# EasyEDA Pro project ProPrj_4进4出_2026-07-08.epro, board PCB1
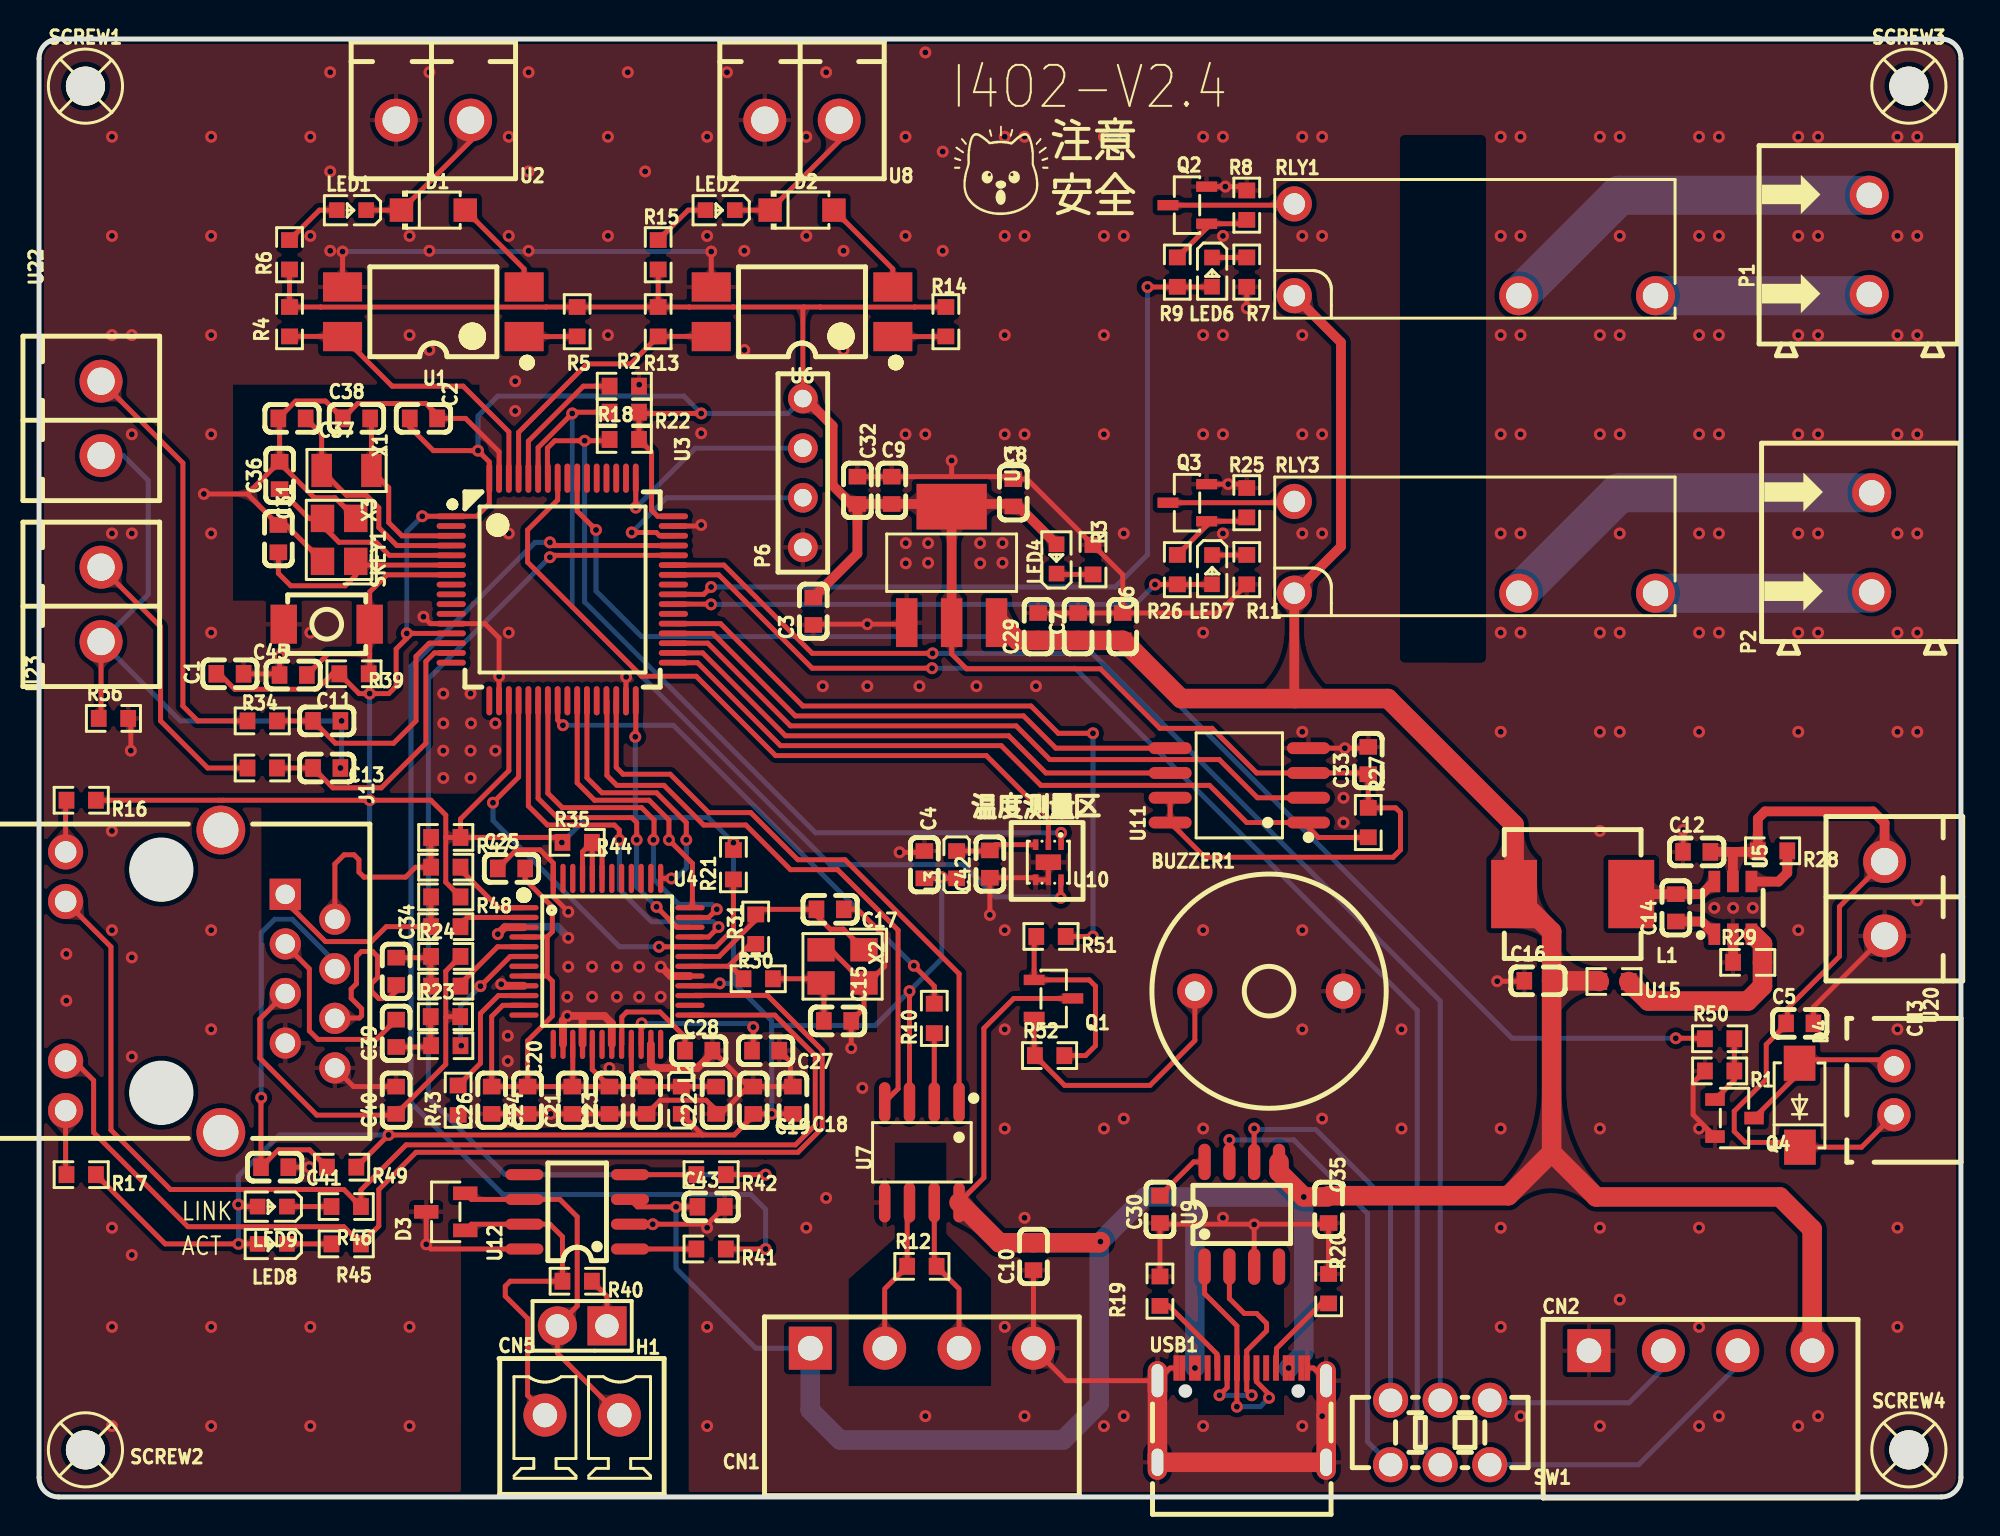
[diagram p8: board, top side]
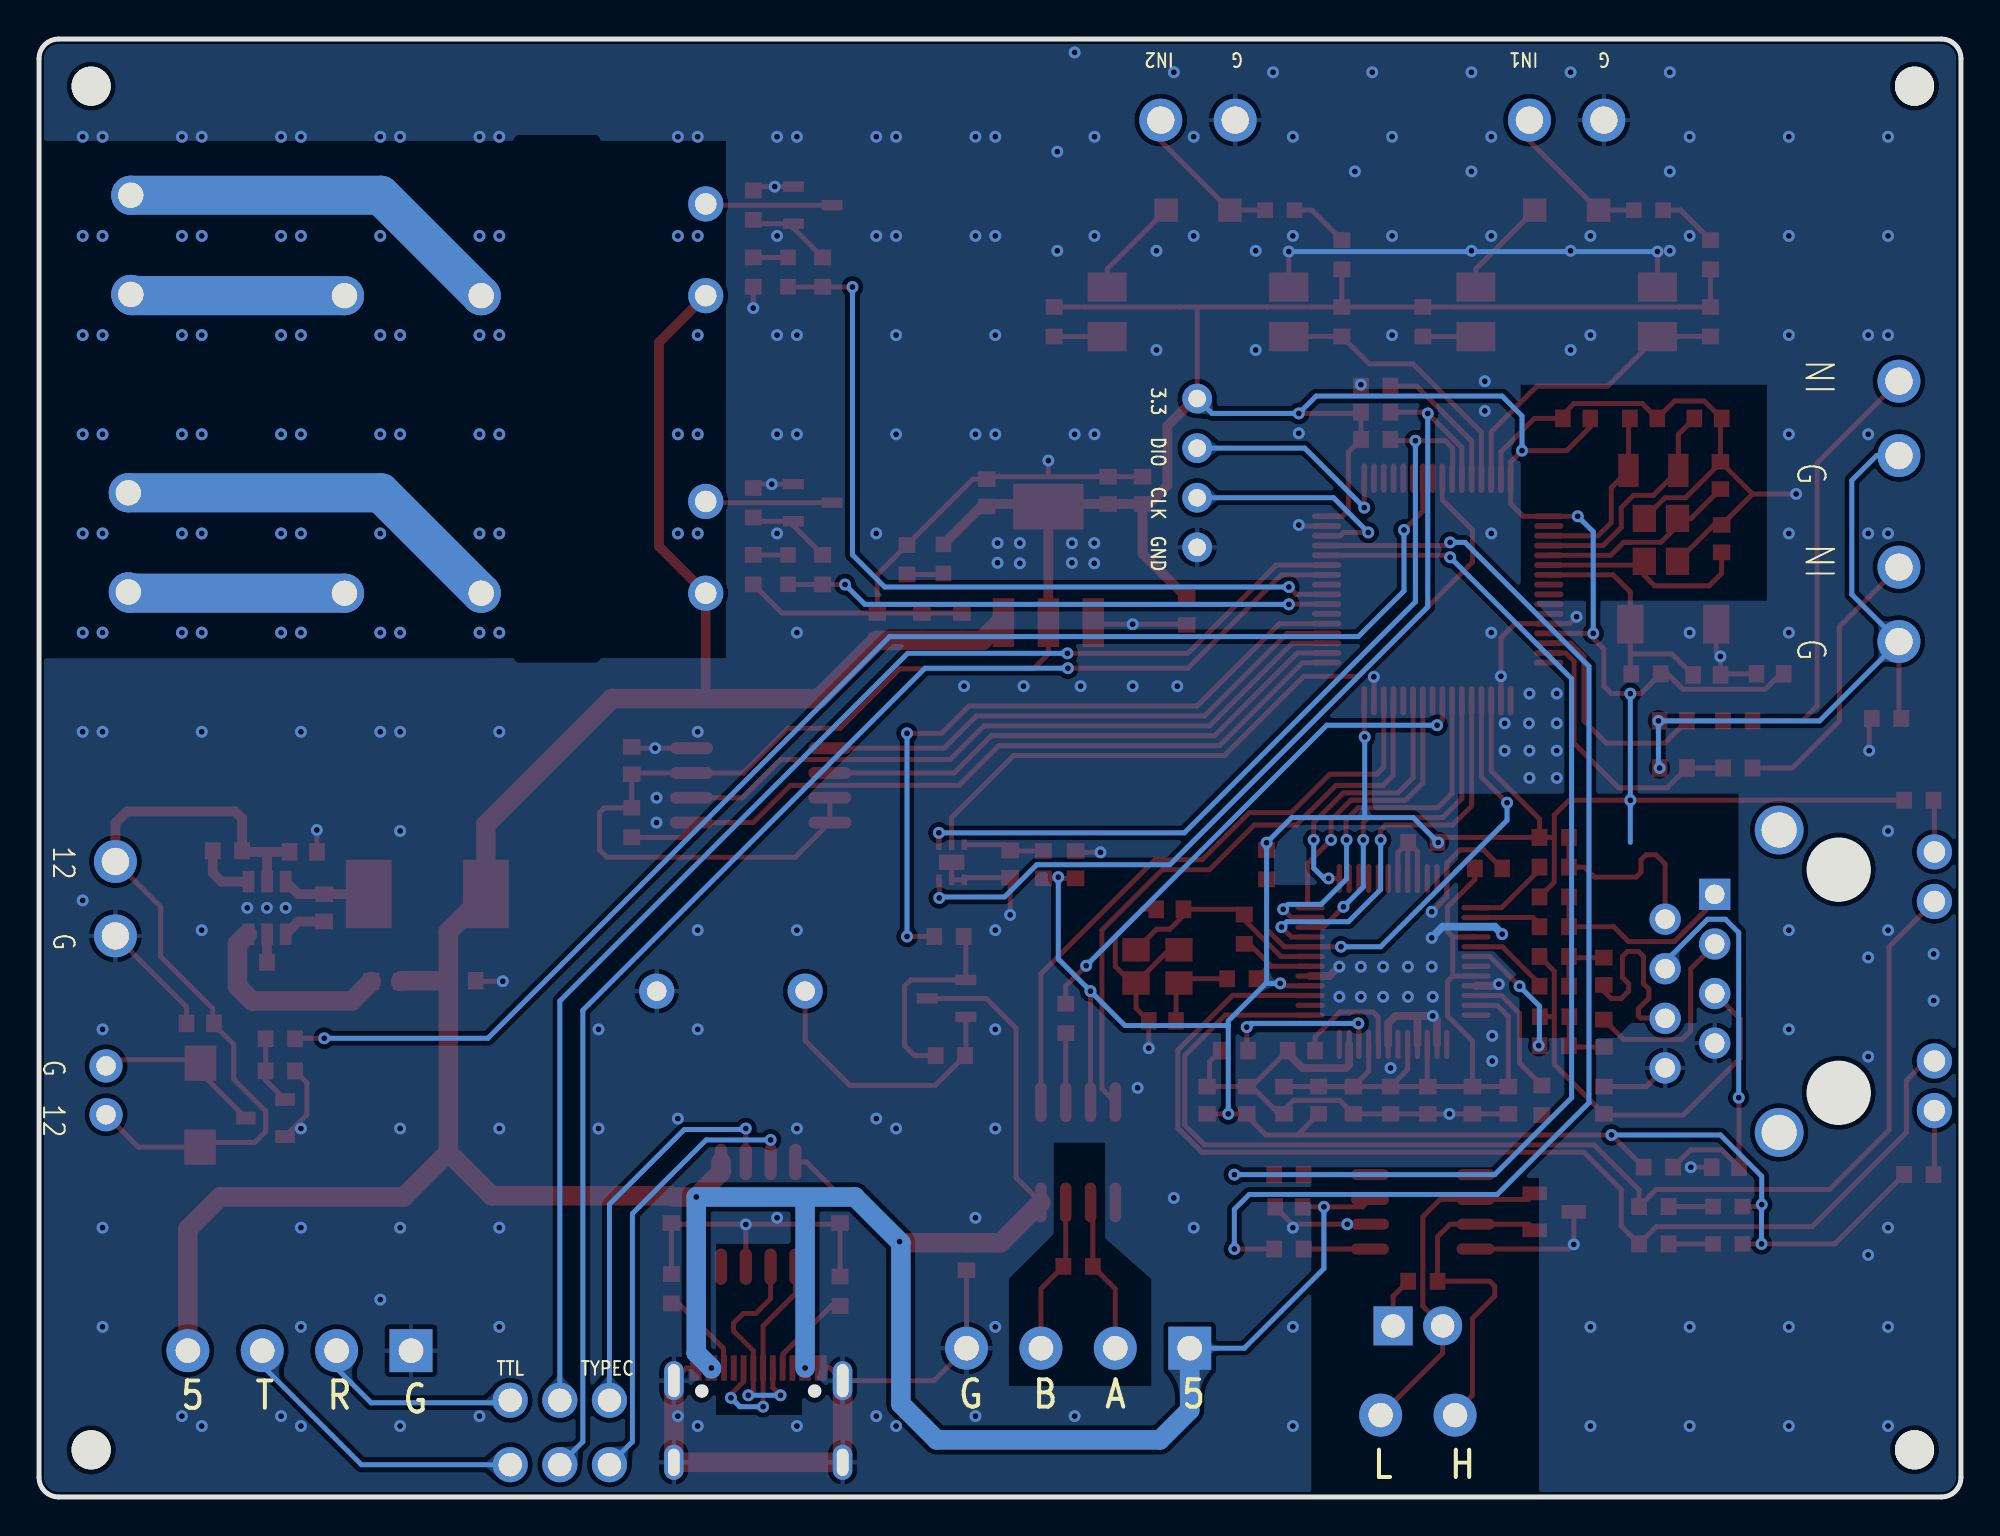
[diagram p9: board, bottom side, seen from below]

Outline 98.42 x 74.68 mm; copper layers: Top Layer, Bottom Layer. Coordinates in mm from the lower left corner of the outline.
Outline path: 0,73.68 0,1 arc(0.29,0.29) 1,0 97.42,0 arc(98.13,0.29) 98.42,1 98.42,73.68 arc(98.13,74.38) 97.42,74.68 1,74.68 arc(0.29,74.38) 0,73.68
Stack: Top Layer 0.035mm / Dielectric1 1.51mm FR4 er 4.5 / Bottom Layer 0.035mm

## Design rules (mm)
net 485_B: DP2
net 485_A: DP2
net TXN: DP3
net TXP: DP3
net RXN: DP4
net RXP: DP4
net $2N96: DP5
net $2N97: DP5
net CANL: DP6
net CANH: DP6
spacing copperThickness1oz (default): track to track 0.102, other pairs 0.152 to 0.3
spacing copperThickness2oz: track to track 0.203, other pairs 0.152 to 0.3
track width copperThickness1oz (default): min 0.127, default 0.254, max 2.54
track width copperThickness2oz: min 0.203, default 0.254, max 2.54
differential pair differentialPair (default): width min 0.127, default 0.254, max 2.54; gap min 0.152, default 0.152
net GND uses copperRegion

## Placement (name value [footprint] x y rotation side)
BUZZER1  2.4kHz  [BUZ-TH_BD12.0-P7.60-D0.6-FD]  62.99 25.91 0 top
C1  100nF  [C0603]  9.78 42.16 180 top
C2  100nF  [C0603]  19.69 55.25 180 top
C3  100nF  [C0603]  39.65 45.37 90 top
C4  100nF  [C0603]  45.34 32.39 270 top
C5  100nF  [C0603]  90.17 24.26 0 top
C6  100nF  [C0603]  55.5 44.58 90 top
C7  100nF  [C0603]  53.21 44.58 90 top
C8  100nF  [C0603]  49.89 51.44 270 top
C9  100nF  [C0603]  43.67 51.56 270 top
C10  100nF  [C0603]  50.93 12.32 90 top
C11  100nF  [C0603]  14.73 39.75 0 top
C12  4.7uF  [C0603]  84.89 33.04 0 top
C13  100nF  [C0603]  14.73 37.34 0 top
C14  100nF  [C0603]  83.82 30.18 90 top
C15  18pF  [C0603]  40.89 24.38 180 top
C16  10uF  [C0603]  76.76 26.44 0 top
C17  18pF  [C0603]  40.51 30.1 180 top
C18  100nF  [C0603]  38.61 20.32 270 top
C19  4.7uF  [C0603]  36.58 20.32 270 top
C20  100nF  [C0603]  25.02 20.32 90 top
C21  100nF  [C0603]  29.21 20.32 90 top
C22  100nF  [C0603]  34.67 20.32 90 top
C23  100nF  [C0603]  31.11 20.32 90 top
C24  100nF  [C0603]  27.3 20.32 90 top
C25  100nF  [C0603]  24.2 32.19 0 top
C26  4.7uF  [C0603]  23.18 20.32 90 top
C27  10nF  [C0603]  37.21 22.86 180 top
C28  4.7uF  [C0603]  33.78 22.86 180 top
C29  10uF  [C0603]  51.16 44.58 90 top
C30  100nF  [C0603]  57.4 14.73 270 top
C31  22pF  [C0603]  12.26 49.09 270 top
C32  10uF  [C0603]  41.91 51.56 270 top
C33  100nF  [C0603]  68.07 37.72 90 top
C34  6.8nF  [C0603]  18.29 26.92 270 top
C35  100nF  [C0603]  66.04 14.73 90 top
C36  22pF  [C0603]  12.32 52.32 270 top
C37  22pF  [C0603]  12.95 55.25 0 top
C38  22pF  [C0603]  16.26 55.25 0 top
C39  6.8nF  [C0603]  18.29 23.75 90 top
C40  10nF  [C0603]  18.29 20.32 90 top
C41  22nF  [C0603]  12.06 16.89 180 top
C42  100nF  [C0603]  48.69 32.42 90 top
C43  100nF  [C0603]  34.42 14.86 0 top
C45  100nF  [C0603]  13.02 42.1 0 top
CN1  WJ15EDGRC-3.81-04P-14-00A  [CONN-TH_WJ15EDGRC-3.81-4P]  45.21 7.62 0 top
CN2  WJ15EDGRC-3.81-04P-14-00A  [CONN-TH_WJ15EDGRC-3.81-4P]  85.09 7.49 0 top
CN3  B2B-XH-A(LF)(SN)  [CONN-TH_B2B-XH-A-LF-SN]  95 20.83 270 top
CN5  WJ15EDGVC-3.81-02P-14-00A  [CONN-TH_WJ15EDGVC-3.81-2P]  27.81 4.19 0 top
D1  SMF5.0A  [SOD-123FL_L2.7-W1.8-LS3.8-RD]  20.19 65.91 0 top
D2  SMF5.0A  [SOD-123FL_L2.7-W1.8-LS3.8-RD]  39.07 65.91 0 top
D3  NUP2105LT1G  [SOT-23-3_L2.9-W1.3-P1.90-LS2.4-BL-2]  20.83 14.61 90 top
D4  SS34  [SMA_L4.3-W2.6-LS5.0-FD]  90.17 20.07 270 top
H1  PZ254V-11-02P  [HDR-TH_2P-P2.54-V-M]  27.81 8.76 180 top
J1  HR911105A  [RJ45-TH_HR911105A]  8.25 26.42 270 top
L1  10uH  [IND-SMD_L7.3-W6.8]  78.54 30.88 180 top
L2  BLM18PG121SN1D  [L0603]  32.89 20.32 90 top
L3  BLM18PG121SN1D  [L0603]  46.99 32.39 90 top
LED1  NCD0603Y2  [LED0603-RD]  16 65.91 180 top
LED2  NCD0603Y2  [LED0603-RD]  34.88 65.91 180 top
LED4  NCD0603Y2  [LED0603-RD]  52.11 48.05 90 top
LED6  NCD0603Y2  [LED0603-RD]  60.07 62.74 270 top
LED7  NCD0603Y2  [LED0603-RD]  60.07 47.5 270 top
LED8  NCD0603Y2  [LED0603-RD]  11.95 12.96 180 top
LED9  NCD0603Y2  [LED0603-RD]  11.95 14.87 180 top
P1  WJ500V-5.08-2P  [CONN-TH_2P-P5.00_WJ500V-5.08-2P]  93.73 64.14 90 top
P2  WJ500V-5.08-2P  [CONN-TH_2P-P5.00_WJ500V-5.08-2P]  93.85 48.9 90 top
P6  4Pin  [4Pin-2.54]  39.12 52.45 90 top
Q1  S8050  [SOT-23-3_L2.9-W1.3-P1.90-LS2.3-BR]  51.95 25.53 180 top
Q2  S8050  [SOT-23-3_L2.9-W1.3-P1.90-LS2.3-BR]  58.8 66.17 0 top
Q3  S8050  [SOT-23-3_L2.9-W1.3-P1.90-LS2.3-BR]  58.8 50.93 0 top
Q4  AO3400A  [SOT-23-3_L2.9-W1.3-P1.90-LS2.4-BR]  86.83 19.41 180 top
R1  10kΩ  [R0603]  86.07 21.82 180 top
R2  1kΩ  [R0603]  29.97 56.9 180 top
R3  1kΩ  [R0603]  53.98 48.01 270 top
R4  10kΩ  [R0603]  12.83 60.2 90 top
R5  500Ω  [R0603]  27.56 60.2 270 top
R6  1kΩ  [R0603]  12.83 63.63 90 top
R7  1kΩ  [R0603]  61.85 62.74 90 top
R8  10kΩ  [R0603]  61.85 66.17 270 top
R9  1kΩ  [R0603]  58.29 62.74 90 top
R10  10kΩ  [R0603]  45.85 24.51 90 top
R11  1kΩ  [R0603]  61.85 47.5 90 top
R12  120Ω  [R0603]  45.21 11.81 0 top
R13  10kΩ  [R0603]  31.71 60.2 90 top
R14  500Ω  [R0603]  46.44 60.2 270 top
R15  1kΩ  [R0603]  31.71 63.63 90 top
R16  470Ω  [R0603]  2.16 35.69 180 top
R17  470Ω  [R0603]  2.16 16.51 180 top
R18  10kΩ  [R0603]  29.97 54.17 0 top
R19  5.1kΩ  [R0603]  57.4 10.54 90 top
R20  5.1kΩ  [R0603]  66.04 10.67 90 top
R21  10kΩ  [R0603]  35.56 32.39 90 top
R22  10kΩ  [R0603]  29.97 55.56 180 top
R23  50Ω  [R0603]  20.81 24.6 0 top
R24  50Ω  [R0603]  20.83 27.69 0 top
R25  10kΩ  [R0603]  61.85 50.93 270 top
R26  1kΩ  [R0603]  58.29 47.5 90 top
R27  4.7K  [R0603_1]  68.07 34.54 270 top
R28  100kΩ  [R0603]  88.78 33.1 180 top
R29  2.1kΩ  [R0603]  87.51 27.38 0 top
R30  0Ω  [R0603]  36.83 26.54 180 top
R31  1MΩ  [R0603]  36.7 29.08 90 top
R32  0Ω  [R0603]  20.83 32.26 180 top
R33  0Ω  [R0603]  20.83 29.21 180 top
R34  1kΩ  [R0603]  11.43 39.75 180 top
R35  1kΩ  [R0603]  11.43 37.34 180 top
R36  0Ω  [R0603]  3.81 39.88 0 top
R37  0Ω  [R0603]  20.83 26.16 180 top
R38  0Ω  [R0603]  20.83 23.11 180 top
R39  10kΩ  [R0603]  16.13 42.16 180 top
R40  120Ω  [R0603]  27.56 11.05 180 top
R41  220Ω  [R0603]  34.42 12.7 180 top
R42  220Ω  [R0603]  34.42 16.51 180 top
R43  12.4kΩ  [R0603]  21.46 20.32 90 top
R44  10kΩ  [R0603]  27.56 33.53 0 top
R45  1kΩ  [R0603]  15.73 12.96 180 top
R46  1kΩ  [R0603]  15.73 14.87 180 top
R47  50Ω  [R0603]  20.83 33.78 180 top
R48  50Ω  [R0603]  20.83 30.73 180 top
R49  10Ω  [R0603]  15.49 16.89 180 top
R50  1kΩ  [R0603]  86.07 23.47 0 top
R51  1kΩ  [R0603]  51.82 28.71 180 top
R52  10kΩ  [R0603]  51.75 22.61 0 top
RLY1  G5NB-1A-E-DC5V  [RELAY-TH_G5NB-1A-E-DCXX]  73.53 63.88 0 top
RLY3  G5NB-1A-E-DC5V  [RELAY-TH_G5NB-1A-E-DCXX]  73.53 48.64 0 top
SCREW1  -  [M2螺丝]  2.38 72.26 0 top
SCREW2  -  [M2螺丝]  2.38 2.41 0 top
SCREW3  -  [M2螺丝]  95.76 72.26 0 top
SCREW4  -  [M2螺丝]  95.76 2.41 0 top
SKEY1  TS-1185-B-A-B-A  [SW-SMD_L4.0-W3.0-LS5.0]  14.73 44.7 0 top
SW1  JS202011CQN  [SW-TH_JS202011CQN]  71.76 3.3 180 top
U1  PC817X2CSP9F  [SMD-4_L4.6-W6.5-P2.54-LS10.2-TL]  20.19 60.71 180 top
U2  2P-P3.81_KF2EDGV-3.81-2P  [CONN-TH_2P-P3.81_KF2EDGV-3.81-2P]  20.19 70.52 180 top
U3  STM32F103RET6  [LQFP-64_L10.0-W10.0-P0.50-LS12.0-BL]  26.8 46.48 270 top
U4  W5500  [LQFP-48_L7.0-W7.0-P0.50-LS9.0-BL]  29.08 27.43 270 top
U5  JW5026  [SOT-23-6_L2.9-W1.6-P0.95-LS2.8-BR]  86.75 30.18 270 top
U6  PC817X2CSP9F  [SMD-4_L4.6-W6.5-P2.54-LS10.2-TL]  39.07 60.71 180 top
U7  MAX13487EESA+T  [SOIC-8_L4.9-W3.9-P1.27-LS6.0-BL]  45.21 17.65 180 top
U8  2P-P3.81_KF2EDGV-3.81-2P  [CONN-TH_2P-P3.81_KF2EDGV-3.81-2P]  39.07 70.52 180 top
U9  CH340N  [SOP-8_L4.9-W3.9-P1.27-LS6.0-BL]  61.6 14.48 0 top
U10  STTS22HTR  [DFN-6_L2.0-W2.0-P0.65-BL-EP1.2]  51.69 32.51 180 top
U11  W25Q64JVSSIQ  [SOP-8_L5.3-W5.3-P1.27-LS8.0-BL]  61.47 36.45 90 top
U12  TJA1050T/CM,118  [SOIC-8_L5.0-W4.0-P1.27-LS6.0-BL]  27.56 14.61 90 top
U13  AMS1117-3.3  [SOT-223-3_L6.5-W3.4-P2.30-LS7.0-BR]  46.74 47.75 270 top
U15  11.2kΩ  [R0603]  80.66 26.4 180 top
U20  2P-P3.81_KF2EDGV-3.81-2P  [CONN-TH_2P-P3.81_KF2EDGV-3.81-2P]  94.51 30.64 90 top
U22  2P-P3.81_KF2EDGV-3.81-2P  [CONN-TH_2P-P3.81_KF2EDGV-3.81-2P]  3.17 55.25 270 top
U23  2P-P3.81_KF2EDGV-3.81-2P  [CONN-TH_2P-P3.81_KF2EDGV-3.81-2P]  3.17 45.72 270 top
USB1  typec  [USB-C-SMD_KH-TYPE-C-16P]  61.6 4.19 0 top
X1  32.768kHz  [CRYSTAL-SMD_L3.2-W1.5-1]  15.75 52.58 0 top
X2  25MHz  [CRYSTAL-SMD_4P-L3.2-W2.5-BL]  41.15 27.18 180 top
X3  8MHz  [CRYSTAL-SMD_4P-L3.2-W2.5-BL]  15.37 49.02 90 top

## Footprints (pads in the part's own frame, mm; a bottom-side part is the same pattern mirrored in y, then rotated)
4Pin-2.54
  round 1.524 hole 0.9: 1(-3.81,0) 2(-1.27,0) 3(1.27,0) 4(3.81,0)
BUZ-TH_BD12.0-P7.60-D0.6-FD
  round 1.8 hole 1: 1(-3.8,0) 2(3.8,0)
C0603
  rect 0.8x0.9 smd: 1(-0.7,0) 2(0.7,0)
CONN-TH_2P-P3.81_KF2EDGV-3.81-2P
  round 2.2 hole 1.4: 1(-1.905,0) 2(1.905,0)
CONN-TH_2P-P5.00_WJ500V-5.08-2P
  round 2 hole 1.3: 1(-2.54,0) 2(2.54,0)
CONN-TH_B2B-XH-A-LF-SN
  round 1.7 hole 1: 1(1.25,0) 2(-1.25,0)
CONN-TH_WJ15EDGRC-3.81-4P
  rect 2.2x2.2 hole 1.26: 1(-5.715,0)
  round 2.2 hole 1.26: 2(-1.905,0) 3(1.905,0) 4(5.715,0)
CONN-TH_WJ15EDGVC-3.81-2P
  round 2.2 hole 1.25: 1(-1.905,0) 2(1.905,0)
CRYSTAL-SMD_4P-L3.2-W2.5-BL
  rect 1.4x1.2 smd: 1(-1.1,-0.85) 2(1.1,-0.85) 3(1.1,0.85) 4(-1.1,0.85)
CRYSTAL-SMD_L3.2-W1.5-1
  rect 1.05x1.7 smd: 1(-1.275,0) 2(1.275,0)
DFN-6_L2.0-W2.0-P0.65-BL-EP1.2
  rect 0.28x0.55 smd: 1(-0.65,-0.9) 2(0.001,-0.9) 3(0.65,-0.9) 4(0.65,0.9) 5(0,0.9) 6(-0.65,0.9)
  rect 1.3x0.8 smd: 7(0.001,0)
HDR-TH_2P-P2.54-V-M
  rect 2x2 hole 1.2: 1(-1.27,0)
  round 2 hole 1.2: 2(1.27,0)
IND-SMD_L7.3-W6.8
  rect 2.35x3.5 smd: 1(-3,0) 2(3,0)
L0603
  rect 0.8x0.864 smd: 1(-0.7,0) 2(0.7,0)
LED0603-RD
  rect 0.8x0.8 smd: 1(-0.749,0) 2(0.749,0)
LQFP-48_L7.0-W7.0-P0.50-LS9.0-BL
  oval 0.27x1.5 smd: 1(-2.75,-4.25) 2(-2.25,-4.25) 3(-1.75,-4.25) 4(-1.25,-4.25) 5(-0.75,-4.25) 6(-0.25,-4.25) 7(0.25,-4.25) 8(0.75,-4.25) 9(1.25,-4.25) 10(1.75,-4.25) 11(2.25,-4.25) 12(2.75,-4.25) 25(2.75,4.25) 26(2.25,4.25) 27(1.75,4.25) 28(1.25,4.25) 29(0.75,4.25) 30(0.25,4.25) 31(-0.25,4.25) 32(-0.75,4.25) 33(-1.25,4.25) 34(-1.75,4.25) 35(-2.25,4.25) 36(-2.75,4.25)
  oval 1.5x0.27 smd: 13(4.25,-2.75) 14(4.25,-2.25) 15(4.25,-1.75) 16(4.25,-1.25) 17(4.25,-0.75) 18(4.25,-0.25) 19(4.25,0.25) 20(4.25,0.75) 21(4.25,1.25) 22(4.25,1.75) 23(4.25,2.25) 24(4.25,2.75) 37(-4.25,2.75) 38(-4.25,2.25) 39(-4.25,1.75) 40(-4.25,1.25) 41(-4.25,0.75) 42(-4.25,0.25) 43(-4.25,-0.25) 44(-4.25,-0.75) 45(-4.25,-1.25) 46(-4.25,-1.75) 47(-4.25,-2.25) 48(-4.25,-2.75)
LQFP-64_L10.0-W10.0-P0.50-LS12.0-BL
  oval 0.3x1.5 smd: 1(-3.75,-5.688) 2(-3.25,-5.688) 3(-2.75,-5.688) 4(-2.25,-5.688) 5(-1.75,-5.688) 6(-1.25,-5.688) 7(-0.75,-5.688) 8(-0.25,-5.688) 9(0.25,-5.688) 10(0.75,-5.688) 11(1.25,-5.688) 12(1.75,-5.688) 13(2.25,-5.688) 14(2.75,-5.688) 15(3.25,-5.688) 16(3.75,-5.688) 33(3.75,5.688) 34(3.25,5.688) 35(2.75,5.688) 36(2.25,5.688) 37(1.75,5.688) 38(1.25,5.688) 39(0.75,5.688) 40(0.25,5.688) 41(-0.25,5.688) 42(-0.75,5.688) 43(-1.25,5.688) 44(-1.75,5.688) 45(-2.25,5.688) 46(-2.75,5.688) 47(-3.25,5.688) 48(-3.75,5.688)
  oval 1.5x0.3 smd: 17(5.7,-3.738) 18(5.7,-3.238) 19(5.7,-2.738) 20(5.7,-2.238) 21(5.7,-1.738) 22(5.7,-1.238) 23(5.7,-0.739) 24(5.7,-0.238) 25(5.7,0.262) 26(5.7,0.762) 27(5.7,1.262) 28(5.7,1.762) 29(5.7,2.261) 30(5.7,2.762) 31(5.7,3.261) 32(5.7,3.762) 49(-5.7,3.762) 50(-5.7,3.261) 51(-5.7,2.762) 52(-5.7,2.261) 53(-5.7,1.762) 54(-5.7,1.262) 55(-5.7,0.762) 56(-5.7,0.262) 57(-5.7,-0.238) 58(-5.7,-0.739) 59(-5.7,-1.238) 60(-5.7,-1.738) 61(-5.7,-2.238) 62(-5.7,-2.738) 63(-5.7,-3.238) 64(-5.7,-3.738)
M2螺丝
  round 2 hole 2: 1(0,0)
R0603
  rect 0.806x0.864 smd: 1(-0.753,0) 2(0.753,0)
R0603_1
  rect 0.806x0.864 smd: 1(-0.753,0) 2(0.753,0)
RELAY-TH_G5NB-1A-E-DCXX
  round 1.8 hole 1.1: 1(-9.25,-2.35) 4(-9.25,2.35)
  round 2 hole 1.3: 2(2.25,-2.35) 3(9.25,-2.35)
RJ45-TH_HR911105A
  rect 1.6x1.6 hole 1: 1(-4.45,4.355)
  round 1.6 hole 1: 2(-3.18,6.895) 3(-1.91,4.355) 4(-0.64,6.895) 5(0.63,4.355) 6(1.9,6.895) 7(3.17,4.355) 8(4.44,6.895)
  round 1.8 hole 1.1: 9(-6.625,-6.895) 10(-4.085,-6.895) 11(4.085,-6.895) 12(6.625,-6.895)
  round 2.5 hole 1.8: SH1(-7.745,1.055) SH2(7.745,1.055)
SMA_L4.3-W2.6-LS5.0-FD
  rect 1.8x1.62 smd: 1(-2.15,-0.009) 2(2.15,0.009)
SMD-4_L4.6-W6.5-P2.54-LS10.2-TL
  rect 2x1.5 smd: 1(-4.65,1.27) 2(-4.65,-1.27) 3(4.65,-1.27) 4(4.65,1.27)
SOD-123FL_L2.7-W1.8-LS3.8-RD
  rect 1.2x1.2 smd: 1(-1.635,0) 2(1.635,0)
SOIC-8_L4.9-W3.9-P1.27-LS6.0-BL
  oval 0.588x2.045 smd: 1(-1.905,-2.57) 2(-0.635,-2.57) 3(0.635,-2.57) 4(1.905,-2.57) 5(1.905,2.57) 6(0.635,2.57) 7(-0.635,2.57) 8(-1.905,2.57)
SOIC-8_L5.0-W4.0-P1.27-LS6.0-BL
  oval 0.569x1.95 smd: 1(-1.905,-2.705) 2(-0.635,-2.705) 3(0.635,-2.705) 4(1.905,-2.705) 5(1.905,2.705) 6(0.635,2.705) 7(-0.635,2.705) 8(-1.905,2.705)
SOP-8_L4.9-W3.9-P1.27-LS6.0-BL
  oval 0.63x1.865 smd: 1(-1.905,-2.683) 2(-0.635,-2.683) 3(0.635,-2.683) 4(1.905,-2.683) 5(1.905,2.683) 6(0.635,2.683) 7(-0.635,2.683) 8(-1.905,2.683)
SOP-8_L5.3-W5.3-P1.27-LS8.0-BL
  oval 0.609x2.204 smd: 1(-1.905,-3.542) 2(-0.635,-3.542) 3(0.635,-3.542) 4(1.905,-3.542) 5(1.905,3.542) 6(0.635,3.542) 7(-0.635,3.542) 8(-1.905,3.542)
SOT-23-3_L2.9-W1.3-P1.90-LS2.3-BR
  rect 1.07x0.532 smd: 1(0.99,-0.95) 2(0.99,0.95) 3(-0.99,0)
SOT-23-3_L2.9-W1.3-P1.90-LS2.4-BL-2
  rect 0.7x1.25 smd: 1(-0.95,-1) 2(0.95,-1) 3(0,1)
SOT-23-3_L2.9-W1.3-P1.90-LS2.4-BR
  rect 1x0.65 smd: 1(1,-0.95) 2(1,0.95) 3(-1,0)
SOT-23-6_L2.9-W1.6-P0.95-LS2.8-BR
  rect 1.1x0.6 smd: 1(1.35,-0.95) 2(1.35,0) 3(1.35,0.95) 4(-1.35,0.95) 5(-1.35,0) 6(-1.35,-0.95)
SOT-223-3_L6.5-W3.4-P2.30-LS7.0-BR
  rect 2.5x1.1 smd: 1(2.97,-2.3) 2(2.97,0) 3(2.97,2.3)
  rect 2.34x3.6 smd: 4(-2.97,0)
SW-SMD_L4.0-W3.0-LS5.0
  rect 1.35x2 smd: 1(-2.2,0) 2(2.2,0)
SW-TH_JS202011CQN
  round 1.8 hole 1.2: 1(-2.54,-1.65) 2(0,-1.65) 3(2.54,-1.65) 4(-2.54,1.65) 5(0,1.65) 6(2.54,1.65)
USB-C-SMD_KH-TYPE-C-16P
  oval 1x2 hole 0.6x1.7: 1(-4.32,1.765) 2(4.32,1.765)
  oval 1x1.8 hole 0.6x1.4: 3(-4.32,-2.415) 4(4.32,-2.415)
  rect 0.3x1.3 smd: A1(-3.35,2.415) A4(-2.55,2.415) A5(-1.25,2.415) A6(-0.25,2.415) A7(0.25,2.415) A8(1.25,2.415) A9(2.55,2.415) A12(3.35,2.415) B1(3.05,2.415) B4(2.25,2.415) B5(1.75,2.415) B6(0.75,2.415) B7(-0.75,2.415) B8(-1.75,2.415) B9(-2.25,2.415) B12(-3.05,2.415)

## Nets
As in the schematic, except:
VCC3.3: C1.2 C2.2 C3.2 C4.2 C8.2 C9.2 C18.2 C19.2 C32.2 C33.1 L2.1 L3.1 LED4.2 LED8.2 LED9.2 P6.4 R4.2 R5.1 R6.1 R13.2 R14.1 R15.1 R16.1 R17.1 R18.2 R21.2 R22.1 R27.1 R39.2 R44.1 R47.1 R48.1 R49.1 U3.1 U3.13 U3.19 U3.32 U3.48 U3.64 U4.28 U7.3 U11.3 U11.7 U11.8 U13.2 U13.4
$2N103: J1.9 R16.2
$2N104: J1.12 R17.2

Pads without a net: J1 SH1 SH2; SCREW1 1; SCREW2 1; SCREW3 1; SCREW4 1; U4 7 12 13 18 24 26 38 39 40 41 42 46 47; U9 4; U12 5; USB1 A8 B8

## Via types
v1: diameter 0.61, hole 0.305, Top Layer to Bottom Layer, 360 vias

## Routing (per net, layer and track width the routed paths; a pad name or vN(x,y) marks a point on that pad's centre or on a via; arc(x,y) is an arc through that point)
12V: length 40.7
  Top Layer w0.254: CN3.1 93.33,17.92 D4.2 89.93,18.16 87.38,18.16 86.82,18.72 86.82,19.76 88.45,21.4 88.45,23.18 89.47,24.19 C5.1 89.54,24.32 89.54,25.02 92.2,27.69 92.2,30.24 U20.2
  Top Layer w0.5: 86.81,33.04 87.97,33.04 R28.2 88.02,34.75 88.39,35.12 93.92,35.12 94.51,34.52 U20.2 ; 86.81,33.04 C12.2 ; 86.81,33.04 86.75,32.98 U5.5
+5V: length 205.2
  Top Layer w0.254: U7.8 48.39,16.35 48.39,24 49.92,25.53 Q1.3 ; U12.3 30.64,14.86 v1(32.62,14.86) C43.1
  Top Layer w0.5: 64.3,40.89 64.28,40.91 RLY3.1 66.67,48.68 66.67,59.14 RLY1.1
  Top Layer w1: C16.2 77.46,17.65 ; C16.2 77.46,28.96 L1.2 75.54,34.44 69.08,40.89 58.48,40.89 C6.1 C7.1 C29.1 50.11,43.88 49.13,44.86 ; C16.2 79.87,26.44 79.91,26.4 ; 77.46,17.65 79.74,15.37 89.15,15.37 90.8,13.72 CN2.4 ; 77.46,17.65 75.25,15.43 C35.2 ; U7.8 49.18,13.02 C10.2 54.29,13.02 v1(54.36,13.08) ; U9.5 63.5,16.64 v1(64.77,15.37) 65.98,15.37
  Bottom Layer w0.254: CN1.1 36.7,7.62 32.62,11.7 v1(32.62,14.86)
  Bottom Layer w1: CN1.1 39.5,4.45 41.02,2.92 52.45,2.92 54.29,4.76 54.29,13.02 v1(54.36,13.08) 56.64,15.37 v1(64.77,15.37) 64.77,7.38 v1(63.99,6.61) 63.99,6.56 ; v1(59.2,6.61) 59.2,15.11
AGND: length 32.6
  Top Layer w0.254: U23.2 3.17,40 R36.1
  Bottom Layer w0.254: v1(15.43,37.34) 15.49,37.4 v1(15.49,39.75) 7.24,39.75 U23.2 5.59,46.23 5.59,52.07 4.32,53.34 U22.2
GND: length 258.3
  Top Layer w0.254: 36.32,21.02 C19.1 38.48,21.02 38.48,22.29 C27.1 ; 36.32,21.02 C28.1 ; 36.32,21.02 34.92,19.62 C22.1 34.67,19.81 34.16,20.32 31.82,20.32 C23.1 C21.1 C24.1 v1(26.2,19.62) C20.1 C26.1 ; C10.1 CN1.4 52.59,5.96 USB1.1 57.92,6.61 58.24,6.61 ; C36.1 12.32,55.18 C37.1 13.14,56.13 14.67,56.13 C38.1 16.32,56.01 19.81,56.01 20.39,55.43 C2.1 21.84,55.25 23.56,53.53 U3.63 ; C36.1 12.32,52.96 14.1,51.18 15.16,51.18 X3.2 ; C36.1 10.67,51.37 ; X2.2 40.55,28.03 X2.4 ; U13.1 44.36,44.7 v1(42.42,44.7) 39.69,44.7 C3.1 39.48,44.49 ; 10.67,51.37 v1(8.44,51.37) ; 10.67,51.37 C31.1 12.65,49.79 14.52,47.92 ; 45.34,33.09 45.27,33.02 v1(44.07,33.02) ; v1(74.68,26.42) 76.04,26.42 C16.1 ; R1.2 84.71,21.22 84.71,19.58 Q4.2 ; 59.79,51.88 v1(60.9,51.88) 61.65,51.88 R25.1 ; 62.24,13.97 v1(62.23,13.96) U9.3 ; 62.24,13.97 65.98,13.97 C35.1 R20.2 ; 62.24,13.97 57.47,13.97 C30.2 R19.2 ; v1(30.07,42.01) 30.06,42 U3.31 ; v1(48.69,29.81) C42.1 50.93,31.72 U10.4 U10.5 ; C6.2 C7.2 C29.2 ; C6.2 55.5,47.24 R3.1 50.6,52.14 C8.1 49.77,52.26 46.75,52.26 ; C6.2 60.38,45.28 R11.1 ; v1(84.2,34.16) 84.2,33.05 C12.1 ; 46.75,52.26 C9.1 C32.1 ; 46.75,52.26 46.74,52.27 v1(46.74,53.09) ; 12.32,43.02 C45.1 12.25,42.16 C1.1 ; X2.4 42.46,26.33 43.31,27.18 43.31,28.7 41.91,30.1 C17.1 ; X2.4 42.25,25.04 C15.1 41.47,24.26 41.59,24.13 v1(41.59,22.99) ; Q2.2 v1(60.75,67.12) 61.65,67.12 R8.1 ; U11.4 v1(66.87,38.35) 68.01,38.35 C33.2 ; U6.3 v1(34.42,63.79) ; U12.8 20.07,12.7 v1(19.83,12.94) D3.3 ; v1(12.32,43.05) 12.53,43.27 SKEY1.1 ; USB1.A12 65.27,6.61 USB1.2 ; R7.1 v1(61.85,60.9) ; R2.1 30.73,56.9 v1(30.73,56.97) ; v1(19.69,45.09) 20.04,44.73 22.83,44.73 23.56,44.01 v1(23.56,42.04) U3.18 ; U3.47 33.86,49.73 v1(33.91,49.78) ; U10.7 51.69,31.61 ; U12.2 v1(31.43,13.97) 34.23,13.97 C43.2 ; v1(27.1,29.97) 26.33,30.74 U4.48 26.33,32.47 25.65,33.15 24.45,33.15 C25.1 ; 15.54,61.98 v1(15.54,63.79) ; J1.8 16.11,21.02 C40.2 ; C5.2 90.87,25.09 U20.1 ; R36.2 4.7,39.74 v1(4.7,38.23) ; C41.1 13.83,16.89
  Top Layer w0.4: U4.14 26.83,24.42 v1(27.05,24.64) 27.81,24.64 ; 24.83,29.18 23.85,29.18 v1(23.5,28.83) ; 31.91,27.11 32.34,26.68 U4.29 ; 27.81,24.64 28.96,24.64 29.33,24.26 U4.19 ; 27.81,24.64 27.83,24.62 U4.16 ; C28.1 34.48,22.73 33.72,21.97 31.5,21.97 31.33,22.13 U4.23 ; v1(23.67,26.27) 23.75,26.18 24.83,26.18
  Top Layer w0.5: U5.2 86.75,28.82 R29.1
  Top Layer w1: USB1.2 USB1.4 USB1.3 USB1.1
  Bottom Layer w0.254: v1(15.54,63.79) v1(34.42,63.79)
  Bottom Layer w0.4: v1(27.1,28.64) 27.1,28.65 26.54,29.21 23.88,29.21 v1(23.5,28.83)
  vias: v1(1.4,27.81) v1(1.4,25.42) v1(3.73,69.67) v1(3.73,64.59) v1(3.73,59.51) v1(3.73,49.35) v1(3.73,34.11) v1(3.73,29.03) v1(3.73,13.79) v1(3.73,8.71) v1(3.73,3.63) v1(4.75,59.51) v1(4.75,54.43) v1(4.75,49.35) v1(4.75,27.64) v1(4.75,22.56) v1(4.75,12.4) v1(8.81,69.67) v1(8.81,64.59) v1(8.81,59.51) v1(8.81,54.43) v1(8.81,49.35) v1(8.81,44.27) v1(8.81,29.03) v1(8.81,23.95) v1(8.81,8.71) v1(8.81,3.63) v1(13.89,69.67) v1(13.89,64.59) v1(13.89,44.27) v1(13.83,16.89) v1(13.89,8.71) v1(13.89,3.63) v1(14.91,72.97) v1(14.91,67.89) v1(14.91,63.83) v1(18.97,64.59) v1(18.97,59.51) v1(18.97,8.71) v1(18.97,3.63) v1(19.99,72.97) v1(19.99,63.83) v1(19.99,58.75) v1(20.7,41.15) v1(20.7,39.62) v1(20.7,38.23) v1(20.7,36.83) v1(22.1,41.15) v1(22.12,39.62) v1(22.1,38.23) v1(22.1,36.83) v1(23.37,39.62) v1(23.37,38.23) v1(24,23.62) v1(24,22.33) v1(24.05,69.67) v1(24.05,64.59) v1(24.05,49.35) v1(24.05,44.27) v1(24.38,57.15) v1(24.38,55.63) v1(25.07,72.97) v1(25.07,67.89) v1(25.07,63.83) v1(27.1,27.16) v1(27.05,25.62) v1(28.32,27.16) v1(28.32,25.62) v1(29.13,69.67) v1(29.13,64.59) v1(29.13,59.51) v1(29.21,21.97) v1(29.59,27.16) v1(29.59,25.62) v1(30.15,72.97) v1(30.73,27.16) v1(30.73,25.62) v1(31.04,67.89) v1(31.83,27.16) v1(31.83,25.62) v1(33.91,54.48) v1(34.21,69.67) v1(34.21,64.59) v1(34.21,13.79) v1(34.21,8.71) v1(34.21,3.63) v1(35.23,72.97) v1(36.12,63.83) v1(36.12,58.75) v1(39.29,69.67) v1(39.29,64.59) v1(39.29,13.79) v1(40.13,41.53) v1(40.31,72.97) v1(40.31,15.32) v1(41.2,63.83) v1(41.2,58.75) v1(42.16,20.96) v1(42.42,41.53) v1(44.37,69.67) v1(44.37,64.59) v1(44.37,54.43) v1(44.39,48.86) v1(44.39,47.82) v1(45.08,41.53) v1(45.39,73.99) v1(45.39,54.43) v1(45.39,4.14) v1(45.53,48.86) v1(45.53,47.85) v1(46.28,68.91) v1(46.28,63.83) v1(48.01,41.53) v1(48.2,48.86) v1(48.2,47.82) v1(49.34,48.86) v1(49.34,47.85) v1(49.45,69.67) v1(49.45,64.59) v1(49.45,59.51) v1(49.45,54.43) v1(49.45,29.03) v1(49.45,23.95) v1(49.45,18.87) v1(49.45,8.71) v1(50.47,69.67) v1(50.47,64.59) v1(50.47,54.43) v1(50.47,14.3) v1(50.47,4.14) v1(51.05,41.53) v1(54.53,69.67) v1(54.53,64.59) v1(54.53,59.51) v1(54.53,54.43) v1(54.53,18.87) v1(54.53,3.63) v1(55.55,69.67) v1(55.55,64.59) v1(55.55,49.35) v1(55.55,19.38) v1(55.55,4.14) v1(59.61,69.67) v1(59.61,59.51) v1(59.61,54.43) v1(59.61,44.27) v1(59.61,29.03) v1(59.61,18.87) v1(59.61,3.63) v1(60.63,69.67) v1(60.63,64.59) v1(60.63,59.51) v1(60.63,54.43) v1(60.63,49.35) v1(60.63,14.3) v1(64.69,69.67) v1(64.69,64.59) v1(64.69,59.51) v1(64.69,54.43) v1(64.69,49.35) v1(64.69,39.19) v1(64.69,29.03) v1(64.69,23.95) v1(64.69,3.63) v1(65.71,69.67) v1(65.71,64.59) v1(65.71,54.43) v1(65.71,49.35) v1(65.71,19.38) v1(65.71,4.14) v1(66.8,35.81) v1(66.8,34.54) v1(69.77,23.95) v1(69.77,18.87) v1(74.85,69.67) v1(74.85,64.59) v1(74.85,59.51) v1(74.85,54.43) v1(74.85,49.35) v1(74.85,44.27) v1(74.85,39.19) v1(74.85,18.87) v1(74.85,13.79) v1(74.85,8.71) v1(75.87,69.67) v1(75.87,64.59) v1(75.87,59.51) v1(75.87,54.43) v1(75.87,49.35) v1(75.87,44.27) v1(75.87,4.14) v1(79.93,69.67) v1(79.93,59.51) v1(79.93,54.43) v1(79.93,44.27) v1(79.93,39.19) v1(79.93,34.11) v1(79.93,18.87) v1(79.93,13.79) v1(79.93,3.63) v1(80.95,69.67) v1(80.95,64.59) v1(80.95,59.51) v1(80.95,54.43) v1(80.95,49.35) v1(80.95,44.27) v1(80.95,39.19) v1(80.95,10.11) v1(85.01,69.67) v1(85.01,64.59) v1(85.01,59.51) v1(85.01,54.43) v1(85.01,49.35) v1(85.01,44.27) v1(85.01,39.19) v1(85.01,18.87) v1(85.01,13.79) v1(85.01,8.71) v1(85.01,3.63) v1(85.8,30.18) v1(86.03,69.67) v1(86.03,64.59) v1(86.03,59.51) v1(86.03,54.43) v1(86.03,49.35) v1(86.03,44.27) v1(86.03,4.14) v1(86.76,30.18) v1(87.76,30.18) v1(90.09,69.67) v1(90.09,64.59) v1(90.09,59.51) v1(90.09,54.43) v1(90.09,49.35) v1(90.09,44.27) v1(90.09,39.19) v1(90.09,29.03) v1(90.09,3.63) v1(91.11,69.67) v1(91.11,64.59) v1(91.11,59.51) v1(91.11,54.43) v1(91.11,49.35) v1(91.11,44.27) v1(91.11,4.14) v1(95.17,69.67) v1(95.17,64.59) v1(95.17,59.51) v1(95.17,54.43) v1(95.17,49.35) v1(95.17,44.27) v1(95.17,39.19) v1(95.17,23.95) v1(95.17,13.79) v1(95.17,8.71) v1(96.19,69.67) v1(96.19,64.59) v1(96.19,59.51) v1(96.19,54.43) v1(96.19,49.35) v1(96.19,44.27) v1(96.19,39.19) v1(96.19,30.56)
VCC3.3: length 325.5
  Top Layer w0.254: U4.28 34.74,26.18 v1(34.86,26.31) ; R17.1 6.46,12.96 v1(10.21,12.96) LED8.2 ; C2.2 18.98,54.8 20.19,53.59 v1(22.48,53.59) 23.06,53.01 U3.64 23.06,50.87 22.42,50.23 v1(19.62,50.23) ; U7.3 v1(44.58,25.91) ; U3.48 31.68,50.23 31.37,50.55 31.37,53.52 R18.2 R22.1 30.79,55.63 30.92,55.5 v1(33.91,55.5) ; 21.11,44.23 v1(18.83,44.23) 18.83,43.98 18.29,43.43 18.29,41.53 17.91,41.15 v1(16.93,41.15) 16.39,41.15 R39.2 15.03,42.16 14.23,41.37 10.03,41.37 9.23,42.16 C1.2 ; U11.7 U11.8 59.7,32.77 69.34,32.77 69.72,33.15 69.72,35.05 69.48,35.3 R27.1 68.07,37.02 68.01,37.08 U11.3 62.36,37.08 60.07,39.37 57.4,39.37 54.36,42.42 47.5,42.42 46.74,43.18 U13.2 ; R13.2 R5.1 25.96,60.95 25.96,60.95 14.43,60.95 14.42,60.95 R4.2 R6.1 ; R13.2 R15.1 ; R13.2 33.3,60.95 33.31,60.95 35.54,60.95 35.54,60.95 39.17,60.95 ; R48.1 20.83,31.49 20.83,33.78 ; L2.1 33.97,18.54 ; 33.97,18.54 35.6,18.54 36.58,19.52 C19.2 v1(37.52,19.62) 38.48,19.62 ; 33.97,18.54 v1(17.9,18.54) R49.1 ; v1(26.77,33.52) 26.51,33.78 R47.1 ; U3.32 30.56,38.96 ; v1(10.2,14.98) 10.31,14.87 LED9.2 ; R47.1 21.58,34.72 24.06,37.2 U3.19 ; R47.1 20.83,33.78 ; C4.2 L3.1 ; 20.83,33.78 20.83,34.93 20.07,35.69 v1(16.93,35.69) 9.41,35.69 arc(9.31,35.69) 9.22,35.69 R16.1 ; 39.17,60.95 39.12,60.89 P6.4 ; 39.17,60.95 40,60.95 40.01,60.95 44.84,60.95 44.84,60.95 R14.1
  Top Layer w0.5: C32.2 41.91,48.33 C3.2 ; C32.2 41.91,50.86 41.6,50.86 40.64,51.82 40.64,54.86 39.24,56.26 P6.4 ; C32.2 C9.2 49.77,50.86 C8.2 50.17,50.74 52.11,48.79 ; U13.2 U13.4
  Bottom Layer w0.254: 16.93,33.53 v1(16.93,35.69) v1(16.93,41.15) ; P6.4 38.35,55.5 v1(33.91,55.5) 33.02,56.39 23.5,56.39 22.48,55.37 v1(22.48,53.59) ; 30.54,34.8 28.05,34.8 v1(26.77,33.52) ; 30.54,34.8 v1(30.54,38.93) ; 30.54,34.8 34.27,34.8 v1(35.56,33.51) 35.56,26.35 35.6,26.31 ; 35.6,26.31 37.52,24.38 37.52,24.15 ; 35.6,26.31 35.12,26.31 ; 37.52,24.15 42.82,24.15 v1(44.58,25.91) 46.23,27.56 v1(46.23,31.75) ; 37.52,24.15 v1(37.52,19.62) ; v1(18.83,44.23) 18.83,49.44 v1(19.62,50.23) ; v1(10.21,12.96) 10.21,14.97 v1(10.2,14.98) 10.2,16.43 12.32,18.54 18.03,18.54
3.3A: length 38.6
  Top Layer w0.254: 24.83,28.68 26.02,28.68 ; 26.02,28.68 26.29,28.96 26.29,30.23 24.89,31.62 24.89,31.92 ; 26.02,28.68 26.02,28.67 26.02,26.81 ; U4.21 30.33,21.8 C23.2 ; C21.2 C23.2 ; C21.2 C24.2 ; C21.2 28.33,21.9 U4.17 ; C23.2 L2.2 C22.2 ; 23.18,21.09 23.18,24.61 23.75,25.18 24.83,25.18 ; C24.2 27.33,21.05 U4.15 ; C24.2 C20.2 ; C20.2 C26.2 ; C20.2 25.02,23.37 26.29,24.64 26.29,26.42 26.02,26.68 24.83,26.68
485_A: length 7.9
  Top Layer w0.254: CN1.2 43.31,10.53 ; U7.6 44.46,14.96 R12.1 43.31,10.66
485_B: length 7.9
  Top Layer w0.254: U7.7 45.85,11.93 R12.2 47.12,10.66 ; CN1.3 47.12,10.53
ACTLED: length 59.4
  Top Layer w0.254: J1.11 1.8,22.33 2.79,21.34 2.79,18.67 7.62,13.84 15.6,13.84 R45.1 17.4,13.88 17.4,15.75 19.3,17.65 38.86,17.65 40.11,18.9 40.11,22.89 37.3,25.69 33.6,25.69 33.59,25.68
CAN_RXD: length 3.4
  Top Layer w0.254: U12.4 R42.2
CAN_TXD: length 3.4
  Top Layer w0.254: U12.1 R41.2
CANH: length 18.1
  Top Layer w0.254: CN5.1 25.91,4.32 25.02,5.21 25.02,9.14 23.88,10.29 23.88,10.8 24.13,11.05 R40.2 26.81,13.33 26.16,13.97 U12.7 22.14,13.97 21.83,13.66
CANL: length 18.1
  Top Layer w0.254: D3.2 22.14,15.24 U12.6 26.67,15.24 27.56,14.35 27.56,9.78 H1.2 26.54,7.37 CN5.2
D+: length 11.5
  Top Layer w0.254: v1(61.35,4.62) USB1.A6 61.35,8.76 59.69,10.41 U9.1 ; v1(62.99,5.08) 62.99,5.26 62.35,5.91 USB1.B6
  Bottom Layer w0.254: v1(61.35,4.62) 62.54,4.62 v1(62.99,5.08)
D-: length 11.5
  Top Layer w0.254: USB1.B7 60.85,5.6 v1(60.45,5.21) ; v1(62.1,5.21) 61.85,5.47 USB1.A7 61.85,7.49 62.86,8.51 62.86,8.89 62.36,9.4 61.72,9.4 60.96,10.16 U9.2
  Bottom Layer w0.254: v1(60.45,5.21) v1(62.1,5.21)
FAN_CONTROL: length 72.8
  Top Layer w0.254: 85.59,23.5 85.34,23.5 ; 85.34,23.5 85.34,23.5 ; 85.34,23.5 85.31,23.47 ; 85.34,23.5 v1(83.82,23.5) ; 27.56,52.18 27.56,50.5 v1(28.52,49.53)
  Bottom Layer w0.254: v1(28.52,49.53) 28.52,46.41 30.86,44.07 54.86,44.07 75.44,23.5 v1(83.82,23.5)
Fan_Control: length 0
  Top Layer w0.254: 85.6,23.5 85.59,23.5
Fan_Power-_IN: length 8.8
  Top Layer w0.254: CN3.2 94.68,22.4 90.34,22.4 D4.1 90.16,21.74 Q4.3
IIC1_SCL: length 43.1
  Top Layer w0.254: U10.1 52.34,34.01 v1(52.34,34.02) ; U3.58 26.04,52.21 26.04,53.73 26.41,54.1 v1(27.94,54.1) 29.15,54.1 R18.1
  Bottom Layer w0.254: v1(27.94,54.1) 27.94,45.85 39.77,34.02 v1(52.34,34.02)
IIC1_SDA: length 48
  Top Layer w0.254: R22.2 27.37,55.56 v1(27.3,55.5) 25.56,53.75 U3.59 ; v1(52.32,30.68) 52.32,31.6 U10.6
  Bottom Layer w0.254: v1(27.3,55.5) 27.3,45.59 40.51,32.39 47.33,32.39 48.98,30.73 52.32,30.73
IIC-A-3.3: length 4.2
  Top Layer w0.254: U10.3 48.99,33.41 C42.2 48.66,33.09 46.99,33.09
IN1: length 7.9
  Top Layer w0.254: U2.1 22.1,69.45 D1.1 16.75,65.91
IN2: length 7.9
  Top Layer w0.254: U8.1 40.98,69.45 D2.1 LED2.1
INTN: length 14.7
  Top Layer w0.254: 33.33,30.18 33.46,30.31 33.46,32.45 v1(32.26,33.66) 32.26,34.67 31.24,35.69 28.45,35.69 27.56,36.58 27.56,40.78
LINKLED: length 63.4
  Top Layer w0.254: J1.10 3.68,28.18 3.68,18.8 6.73,15.75 15.61,15.75 R46.1 16.48,15.72 18.8,18.03 38.73,18.03 39.75,19.05 39.75,22.61 38.33,24.03 38.33,24.03 38.12,24.24 38.12,24.24 37.67,24.68 U4.25
MISO: length 17.5
  Top Layer w0.254: v1(31.62,30.23) 32.3,29.55 32.3,29.51 32.55,29.27 32.58,29.27 32.67,29.18 U4.34 ; U3.22 25.56,35.78 26.54,34.8 30.35,34.8 30.61,34.54 v1(30.61,33.66)
  Bottom Layer w0.254: v1(30.61,33.66) 30.61,31.24 v1(31.62,30.23)
MOSI: length 19.2
  Top Layer w0.254: U3.23 26.06,36.04 26.8,35.31 30.86,35.31 31.5,34.67 31.5,33.69 v1(31.46,33.66) ; U4.35 34.29,29.68 v1(34.71,30.1)
  Bottom Layer w0.254: v1(31.46,33.66) 31.46,31.66 32.77,30.35 34.46,30.35 v1(34.71,30.1)
NRST: length 12.4
  Top Layer w0.254: C45.2 14.8,43.18 16.93,43.18 16.93,43.18 ; 16.93,43.18 16.93,42.21 R39.1 ; 16.93,43.18 SKEY1.2 16.93,46.36 17.81,47.23 21.11,47.23
PA0: length 13.5
  Top Layer w0.254: R34.1 C11.1 15.17,38.61 18.16,38.61 19.3,39.75 19.3,43.05 19.98,43.72 20.02,43.72 20.03,43.73 21.11,43.73
PA1: length 14.7
  Top Layer w0.254: 21.11,43.23 20.25,43.23 19.81,42.8 19.81,38.61 17.53,36.32 15.05,36.32 C13.1 R35.1
PA4: length 24.6
  Top Layer w0.254: R21.1 35.56,29.08 34.66,28.18 U4.32 v1(31.75,28.18) ; v1(23.25,35.56) 24.56,36.87 U3.20
  Bottom Layer w0.254: v1(31.75,28.18) 29.72,28.18 23.25,34.66 v1(23.25,35.56)
PA5: length 21.2
  Top Layer w0.254: U3.21 25.06,35.39 26.04,34.42 29.46,34.42 29.72,34.16 v1(29.72,33.66) ; v1(34.8,29.19) 34.29,28.68 U4.33
  Bottom Layer w0.254: v1(29.72,33.66) 29.72,31.12 31.37,29.46 34.52,29.46 v1(34.8,29.19)
PA9: length 71.1
  Top Layer w0.254: U3.42 34.81,47.23 39.59,42.45 v1(45.73,42.45)
  Bottom Layer w0.254: SW1.5 70.58,2.83 70.58,24.93 53.05,42.45 v1(45.73,42.45)
PA10: length 69
  Top Layer w0.254: v1(45.76,43.21) 39.59,43.21 35.07,47.73 U3.43
  Bottom Layer w0.254: SW1.2 71.76,25.4 53.94,43.21 v1(45.76,43.21)
PA11: length 57.6
  Top Layer w0.254: v1(26.16,48.13) 26.26,48.23 U3.44 ; R42.1 v1(37.21,16.51)
  Bottom Layer w0.254: v1(37.21,16.51) 23.88,16.51 19.94,20.45 19.94,41.91 v1(26.16,48.13)
PA12: length 63
  Top Layer w0.254: U3.45 26.33,48.73 v1(26.16,48.9) ; R41.1 v1(37.21,12.7)
  Bottom Layer w0.254: v1(37.21,12.7) 37.21,14.73 36.45,15.49 23.75,15.49 19.05,20.19 19.05,42.55 25.4,48.9 v1(26.16,48.9)
PB1: length 13.8
  Top Layer w0.254: U3.27 28.06,36.84 28.83,36.07 31.62,36.07 33.15,34.54 v1(33.15,33.66) ; U4.37 v1(32.39,31.68)
  Bottom Layer w0.254: v1(33.15,33.66) 33.15,32.21 32.62,31.68 v1(32.39,31.68)
PB5: length 38.5
  Top Layer w0.254: 51.69,33.29 51.69,33.29 51.69,34.8 48.51,37.97 37.72,37.97 33.65,42.04 30.86,42.04 25.02,47.88 25.02,49.53 26.56,51.07 U3.57
PB8: length 14.3
  Top Layer w0.254: U3.61 24.56,54.53 28.07,58.04 30.3,58.04 R13.1 34.42,59.44 U6.4
PB9: length 15.6
  Top Layer w0.254: R4.1 15.53,59.44 18.08,56.9 21.72,56.9 24.06,54.55 U3.62
PB10: length 31.1
  Top Layer w0.254: U7.4 43.99,20.91 43.99,29.03 40.89,32.13 38.48,32.13 36.2,34.42 34.04,34.42 32,36.45 29.59,36.45 29.08,36.96 29.08,40.76 U3.29
PB11: length 31.9
  Top Layer w0.254: U3.30 29.56,37.37 29.91,37.02 32.32,37.02 34.29,35.05 36.45,35.05 38.86,32.64 41.27,32.64 47.12,26.8 U7.1
PB12: length 39.3
  Top Layer w0.254: U11.1 61.85,34.54 59.94,36.45 51.31,36.45 49.28,38.48 37.97,38.48 33.72,42.73 U3.33 ; 68.07,33.78 65.52,33.78 64.95,34.35
PB13: length 28
  Top Layer w0.254: U3.34 33.98,43.23 38.23,38.99 49.66,38.99 51.56,37.08 U11.6
PB14: length 35.8
  Top Layer w0.254: U3.35 34.25,43.73 38.48,39.5 50.04,39.5 51.76,37.77 60.44,37.77 62.4,35.81 U11.2
PB15: length 27.9
  Top Layer w0.254: U3.36 34.51,44.23 38.73,40.01 50.42,40.01 52.07,38.35 U11.5
PC4: length 26.8
  Top Layer w0.254: U3.24 26.56,39.8 v1(26.83,39.53) ; v1(44.8,27.21) 45.85,26.16 R10.2
  Bottom Layer w0.254: v1(26.83,39.53) 32.48,39.53 v1(44.8,27.21)
PC6: length 35.6
  Top Layer w0.254: v1(53.98,39.12) 52.2,39.12 50.8,40.51 39.12,40.51 34.9,44.73 U3.37 ; R51.1 v1(53.98,28.71)
  Bottom Layer w0.254: v1(53.98,28.71) v1(53.98,39.12)
PC8: length 28
  Top Layer w0.254: U3.39 34.4,45.73 v1(34.42,45.72) ; v1(57.15,46.74) 60.06,46.74 60.07,46.75
  Bottom Layer w0.254: v1(57.15,46.74) 56.13,45.72 v1(34.42,45.72)
PC9: length 42.1
  Top Layer w0.254: v1(34.42,46.61) 34.04,46.23 U3.40 ; LED6.2 60.06,61.98 v1(56.77,61.98)
  Bottom Layer w0.254: v1(34.42,46.61) 55.12,46.61 56.77,48.26 v1(56.77,61.98)
RXN: length 3.2
  Top Layer w0.254: C34.1 19.89,27.62 ; 20.01,27.62 R24.1 R37.2
RXP: length 3.2
  Top Layer w0.254: R23.1 20.06,23.13 R38.2 20.01,23.05 ; C39.1 19.88,23.05
SWCLK: length 11.3
  Top Layer w0.254: U3.49 v1(30.56,50.67)
  Bottom Layer w0.254: v1(30.56,50.67) 33.61,53.72 P6.3
SWDIO: length 11.7
  Top Layer w0.254: v1(30.35,49.4) 31.61,49.4 31.78,49.23 U3.46
  Bottom Layer w0.254: v1(30.35,49.4) 32.13,51.18 P6.2
TTL_RX: length 9.8
  Bottom Layer w0.254: 83.18,6.73 83.18,6.59 81.41,4.81 ; 74.3,4.83 81.41,4.83
TTL_TX: length 15.7
  Bottom Layer w0.254: 86.99,7.62 86.99,6.73 81.92,1.65 SW1.4
TXN: length 10.4
  Top Layer w0.254: R47.2 R32.2 19.41,32.26 ; J1.2 15.15,32.42 15.62,32.89 16.13,32.89 16.38,32.64 16.38,32 16.64,31.75 18.77,31.75 19.28,32.26
TXP: length 10.4
  Top Layer w0.254: J1.1 12.61,30.51 14.67,28.45 17.02,28.45 17.78,29.21 19.95,29.21 ; R48.2 R33.2
TYPEC-RX: length 23.1
  Top Layer w0.254: U9.7 v1(60.96,18.29)
  Bottom Layer w0.254: v1(60.96,18.29) 64.26,18.29 68.04,14.51 68.04,2.83 SW1.6
TYPEC-TX: length 20.3
  Top Layer w0.254: U9.6 62.23,18.82
  Bottom Layer w0.254: SW1.3 69.21,14.99 65.38,18.82 62.23,18.82
  vias: v1(62.23,18.87)
XTALA: length 10.4
  Top Layer w0.254: C36.2 13.82,50.12 14.52,50.12 14.52,49.75 15.36,48.9 16.93,48.9 16.94,48.9 17.27,48.9 17.94,48.23 21.11,48.23
XTALB: length 11.1
  Top Layer w0.254: 16.22,47.73 16.22,47.21 15.68,46.67 12.89,46.67 12.26,47.31 C31.2 ; 16.22,47.73 21.11,47.73 ; 16.22,47.73 X3.1
XTALC: length 9.2
  Top Layer w0.254: 21.11,49.23 18.59,49.23 17.91,49.91 17.91,51.69 X1.2 17.02,55.18 C38.2
XTALD: length 11.8
  Top Layer w0.254: C37.2 14.47,54.43 X1.1 15.74,51.31 16.76,51.31 17.4,50.67 17.4,49.66 18.32,48.73 21.11,48.73
$1N367: length 4.6
  Top Layer w0.254: R20.1 65.68,9.91 63.37,7.61 63.37,6.63 USB1.B5
$1N370: length 4.7
  Top Layer w0.254: USB1.A5 60.33,6.63 60.33,7.32 57.86,9.79 R19.1
$1N388: length 3
  Top Layer w0.254: C30.1 59.13,17.16 U9.8
$1N586: length 3.5
  Top Layer w0.254: U7.2 R10.1
$1N700: length 22
  Top Layer w0.254: R34.2 8.13,39.75 7.37,40.51 7.37,52.96 U22.1
$1N708: length 14.6
  Top Layer w0.254: U23.1 6.22,44.58 6.22,39.75 8.64,37.34 R35.2
$1N801: length 7.2
  Top Layer w0.254: R2.2 27.88,56.9 25.06,54.08 U3.60
$2N96: length 10
  Top Layer w0.254: J1.6 15.17,24.53 16.41,24.53 16.52,24.65 16.52,25.01 15.98,25.54 15.98,26.02 16.26,26.29 16.26,27.69 16.51,27.94 17.08,27.94 17.34,27.69 17.34,26.61 17.02,26.29 17.02,25.91 17.4,25.53 17.91,25.53 18.29,25.91 C34.2 ; 18.54,26.16 18.54,26.22
$2N97: length 10
  Top Layer w0.254: C39.2 17.28,23.44 14.28,23.44 13.84,23.88 13.84,27.05 12.61,28.28 J1.3
$2N103: length 2.7
  Top Layer w0.254: J1.9 1.36,35.64 R16.2
$2N104: length 3.3
  Top Layer w0.254: R17.2 1.36,16.56 J1.12
$2N112: length 21.4
  Top Layer w0.254: v1(11.38,20.45) 11.36,20.44 C41.2 12.25,17.78 13.85,17.78 R49.2
  Bottom Layer w0.254: v1(11.38,20.45) 11.38,28.91 12.06,29.59 12.97,29.59 15.15,27.42 J1.4
$2N122: length 22.3
  Top Layer w0.254: 20.83,24.57 20.83,22.16 C40.1 18.29,19.56 14.22,19.56 11.3,22.48 11.3,24.48 J1.5 ; 20.83,24.57 20.86,24.6 R23.2 ; 20.83,24.57 20.83,26.93 R24.2
$5N23: length 6
  Top Layer w0.254: U4.20 29.85,23.19 29.85,24.59 30.1,24.84 31.8,24.84 33.08,23.56 C28.2
$5N24: length 8.1
  Top Layer w0.254: C27.2 36.58,22.93 v1(36.58,24.07) ; v1(30.86,24.26) 30.83,24.23 U4.22
  Bottom Layer w0.254: v1(30.86,24.26) 36.39,24.26 v1(36.58,24.07)
$5N28: length 6.8
  Top Layer w0.254: 24.83,25.68 23.52,25.68 22.61,24.77 22.61,22.22 R43.2
$5N40: length 6.3
  Top Layer w0.254: v1(22.61,26.16) 24.13,27.68 24.83,27.68
  Bottom Layer w0.254: v1(22.61,26.16) 21.59,25.15 21.59,23.11
  vias: v1(21.62,23.11)
$5N41: length 4
  Top Layer w0.254: 21.58,26.28 23.48,28.18 24.83,28.18
$5N42: length 3.6
  Top Layer w0.254: 24.83,29.68 21.93,29.68 21.45,29.21
$5N43: length 4.2
  Top Layer w0.254: 24.83,30.18 23.53,30.18 21.45,32.26
$5N45: length 5.9
  Top Layer w0.254: U4.45 27.83,33.05 R44.2 28.33,33.51 ; U4.43 28.83,33.01 28.33,33.51 ; 28.33,33.51 U4.44
$5N59: length 4.6
  Top Layer w0.254: R30.1 39.83,26.54 X2.3 40.19,26.18 C15.2
$5N62: length 2.3
  Top Layer w0.254: R46.2 LED9.1
$5N63: length 2.3
  Top Layer w0.254: R45.2 LED8.1
$5N64: length 11.1
  Top Layer w0.254: X2.1 41.19,29.08 40.51,29.08 39.81,29.78 C17.2 36.97,30.1 R31.2 36.7,29.56 34.83,27.68 U4.31
$5N65: length 4.6
  Top Layer w0.254: 35.3,27.18 35.44,27.18 R30.2 ; 35.3,27.18 36.45,28.33 ; 35.3,27.18 U4.30
$6N3: length 1.8
  Top Layer w0.254: R11.2 61.84,48.25 LED7.1
$6N4: length 1.8
  Top Layer w0.254: R7.2 61.84,63.49 LED6.1
$6N5: length 11
  Bottom Layer w2: RLY1.3 93.66,61.53 P1.1
$6N6: length 11.1
  Bottom Layer w2: RLY3.3 93.79,46.29 93.85,46.36
$6N11: length 5.2
  Top Layer w0.254: U6.2 43.72,62.9 D2.2
$6N12: length 5.2
  Top Layer w0.254: D1.2 24.84,62.9 U1.2
$6N15: length 3.1
  Top Layer w0.254: R6.2 14.36,65.91 LED1.2
$6N16: length 3.1
  Top Layer w0.254: LED2.2 33.24,65.91 R15.2
$6N17: length 2.7
  Top Layer w0.254: U1.1 27.55,59.44 R5.2
$6N18: length 2.7
  Top Layer w0.254: U6.1 46.43,59.44 R14.2
$6N27: length 20.1
  Bottom Layer w2: P1.2 80.93,66.68 RLY1.2
$6N28: length 20.2
  Bottom Layer w2: RLY3.2 80.93,51.44 P2.2
$6N31: length 4.5
  Top Layer w0.254: R9.2 59.79,64.99 Q2.1 61.65,65.22 R8.2
$6N32: length 4.5
  Top Layer w0.254: R25.2 61.65,49.98 Q3.1 59.79,49.75 R26.2
$6N35: length 6.5
  Top Layer w0.254: RLY1.4 64.22,66.17 Q2.3
$6N36: length 6.5
  Top Layer w0.254: Q3.3 64.22,50.93 RLY3.4
$6N39: length 14.3
  Top Layer w0.254: BUZZER1.1 59.19,23.38 56.9,21.08 52.52,21.08 R52.1 50.96,22.64 Q1.2
$6N41: length 10.4
  Top Layer w0.254: R52.2 53.59,22.61 54.1,23.11 54.1,26.16 53.78,26.48 Q1.1 50.96,28.6 51.07,28.71
$7N3: length 10.5
  Top Layer w1: U15.1 82.41,25.4 87.5,25.4 88.26,26.16 R29.2 88.26,28.33 87.76,28.83
$7N4: length 4.5
  Top Layer w0.5: U5.6 85.15,30.88 C14.2 81.55,30.88 L1.1
$7N5: length 2.2
  Top Layer w0.5: U5.1 85.15,29.48 C14.1
$7N6: length 3.2
  Top Layer w0.5: R28.1 89.53,31.97 89.08,31.52 87.7,31.52 U5.4
$7N17: length 1.9
  Top Layer w0.254: R3.2 52.15,47.25 LED4.1
$8N7: length 3.5
  Top Layer w0.254: Q4.1 86.82,21.35 R1.1 R50.2
$10N14: length 2.6
  Top Layer w0.254: R40.1 29.08,10.28 H1.1

## Copper pours and planes (outline as drawn; the poured copper is in the pictures)
GND on Top Layer: -31.88,56.13 72.26,56.13 72.26,-8.25 -31.88,-8.25
GND on Top Layer: -7.37,76.33 103.12,76.33 103.12,-3.56 -7.37,-3.56
GND on Top Layer: -4.57,81.92 101.85,81.92 101.85,3.56 -4.57,3.56
GND on Bottom Layer: -2.29,79.25 103.76,79.25 103.76,3.94 -2.29,3.94
GND on Bottom Layer: -8.25,77.85 104.14,77.85 104.14,-4.57 -8.25,-4.57
GND on Bottom Layer: -29.72,56.13 75.31,56.13 75.31,-8.25 -29.72,-8.25

Small or netless copper shapes (teardrops, artwork), in the pictures only: 649 on Top Layer, 97 on Bottom Layer

## Text on the board
Bottom Silkscreen Layer: TYPEC | TTL | 3.3 | DIO | CLK | GND | G | IN1 | IN2 | 12 | IN | H | L | 5 | A | B | R | T
Top Silkscreen Layer: LINK | ACT | I4O2-V2.4 | 温度测量区 | 注意 / 安全
